# Altium schematic sheet LM2596.SchDoc
size A4
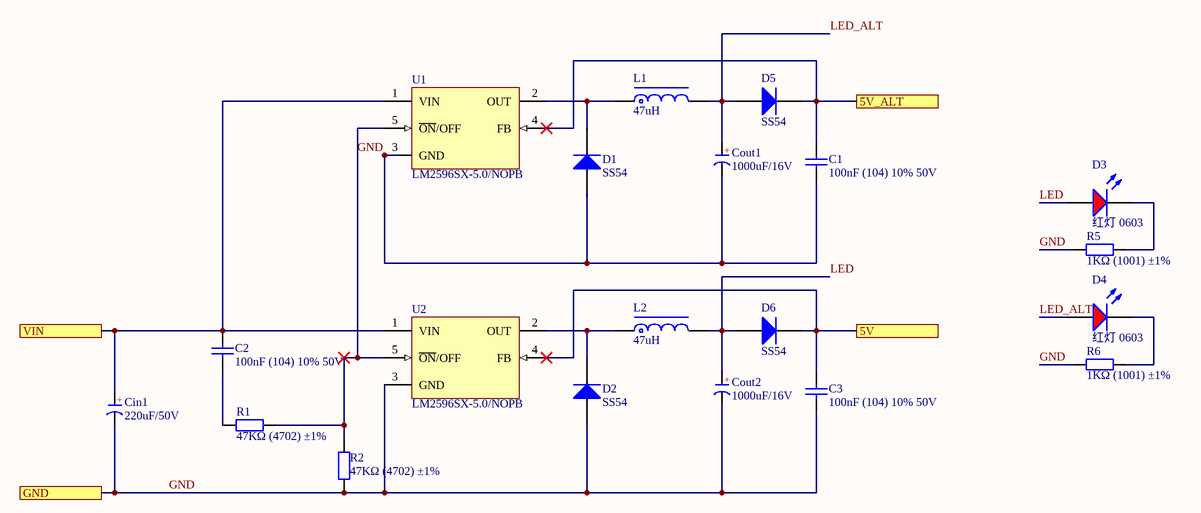
[diagram p0: LM2596.SchDoc]

## Parts
C1  100nF (104) 10% 50V  [0603_C]
C2  100nF (104) 10% 50V  [0603_C]
C3  100nF (104) 10% 50V  [0603_C]
Cin1  220uF/50V  [CM F(10*10.2)]
Cout1  1000uF/16V  [CM F(10*10.2)]
Cout2  1000uF/16V  [CM F(10*10.2)]
D1  SS54  [SMA(DO-214AC)_S1]
D2  SS54  [SMA(DO-214AC)_S1]
D3  红灯 0603  [0603_LED_S1]
D4  红灯 0603  [0603_LED_S1]
D5  SS54  [SMA(DO-214AC)_S1]
D6  SS54  [SMA(DO-214AC)_S1]
L1  47uH  [CDRH127]
L2  47uH  [CDRH127]
R1  47KΩ (4702) ±1%  [0402_R]
R2  47KΩ (4702) ±1%  [0402_R]
R5  1KΩ (1001) ±1%  [0402_R]
R6  1KΩ (1001) ±1%  [0402_R]
U1  LM2596SX-5.0/NOPB  [TO-263-5]
U2  LM2596SX-5.0/NOPB  [TO-263-5]

## Ports
5V, 5V_ALT, GND, VIN

## Nets
5V: C3.2 D6.2(K) U2.4(FB) ; port 5V
5V_ALT: C1.2 D5.2(K) U1.4(FB) ; port 5V_ALT
GND: C1.1 C3.1 Cin1.2(K) Cout1.2(K) Cout2.2(K) D1.1(A) D2.1(A) R2.1 R5.1 R6.1 U1.3(GND) U2.3(GND) ; port GND
LED: Cout2.1(A) D3.A D6.1(A) L2.2
LED_ALT: Cout1.1(A) D4.A D5.1(A) L1.2
VIN: C2.2 Cin1.1(A) U1.1(VIN) U2.1(VIN) ; port VIN
NetC2_1: C2.1 R1.1
NetD1_2: D1.2(K) L1.1 U1.2(OUT)
NetD2_2: D2.2(K) L2.1 U2.2(OUT)
NetD3_K: D3.K R5.2
NetD4_K: D4.K R6.2
NetR1_2: R1.2 R2.2 U1.5(~{ON}/OFF) U2.5(~{ON}/OFF)

## Notes on the sheet
- (in symbol C-CM) +

## Library data of the parts
C1-C3 = 0603 100nF (104) 10% 50V: 贴片电容; ComponentLink1Description: 供应商链接; ComponentLink1URL: http://www.szlcsc.com/product/details_15331.html; Package: 0603; Supplier: LC; SuppliersPartNumber: C14663
Cin1 Cout1 Cout2 = C-CM: 贴片电解电容; 版权归属: 源创客; BOM名称: 贴片电解电容; 学习资源: www.ooocke.com
D1 D2 D5 D6 = SMA(DO-214AC) SS54: 二极管; ComponentLink1Description: 供应商链接; ComponentLink1URL: http://www.szlcsc.com/product/details_23178.html; Package: SMA(DO-214AC); Supplier: LC; SuppliersPartNumber: C22452
D3 D4 = 0603 红灯: 发光二极管; ComponentLink1Description: 供应商链接; ComponentLink1URL: http://www.szlcsc.com/product/details_2659.html; Package: 0603; Supplier: LC; SuppliersPartNumber: C2286
L1 L2 = L-CDRH: 功率屏蔽电感; 版权归属: 源创客; BOM名称: 功率屏蔽电感; 学习资源: www.ooocke.com
R1 R2 = 0402 47KΩ (4702) 1%: 贴片电阻; ComponentLink1Description: 供应商链接; ComponentLink1URL: http://www.szlcsc.com/product/details_26535.html; Package: 0402; Supplier: LC; SuppliersPartNumber: C25792
R5 R6 = 0402 1KΩ (1001) 1%: 贴片电阻; ComponentLink1Description: 供应商链接; ComponentLink1URL: http://www.szlcsc.com/product/details_12256.html; Package: 0402; Supplier: LC; SuppliersPartNumber: C11702
U1 U2 = LM2596SX-5.0/NOPB_[C10002]: DC-DC芯片; ComponentLink1Description: 供应商链接; ComponentLink1URL: http://www.szlcsc.com/product/details_10538.html; Package: TO-263-5; Supplier: LC; SuppliersPartNumber: C10002